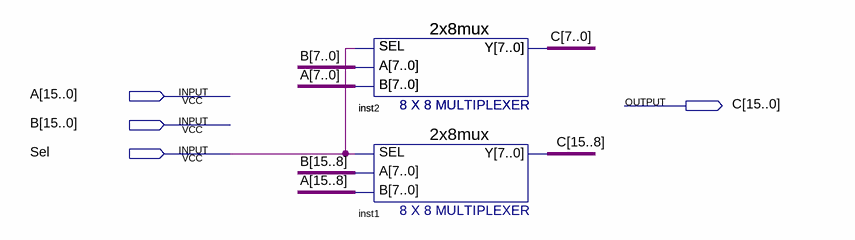
[diagram p0: schematic sheet]
// Quartus schematic mux2x16.bdf as structural Verilog: 3 symbols, 4 pins
module mux2x16 (
  input  [15:0] A,
  input  [15:0] B,
  input  Sel,
  output [15:0] C
);

  \2x8mux  inst (.SEL(Sel), .A(B[7:0]), .B(A[7:0]), .Y(C[7:0]));
  \2x8mux  inst2 (.SEL(Sel), .A(B[7:0]), .B(A[7:0]), .Y(C[7:0]));
  \2x8mux  inst1 (.SEL(Sel), .A(B[15:8]), .B(A[15:8]), .Y(C[15:8]));
endmodule
